# Altium schematic sheet ControlUnit.SchDoc: Control Unit
size A4; CheckedBy: none; Organization: ORGANIZATION; Address1: ADDRESS 1; Address2: ADDRESS 2; Address3: ADDRESS 3; Address4: ADDRESS 4; Revision: -; SheetNumber: 5; SheetTotal: 5; ENG_APP_DATE: --/--/--; DSN_APP_DATE: --/--/--; CHK_APP_DATE: --/--/--
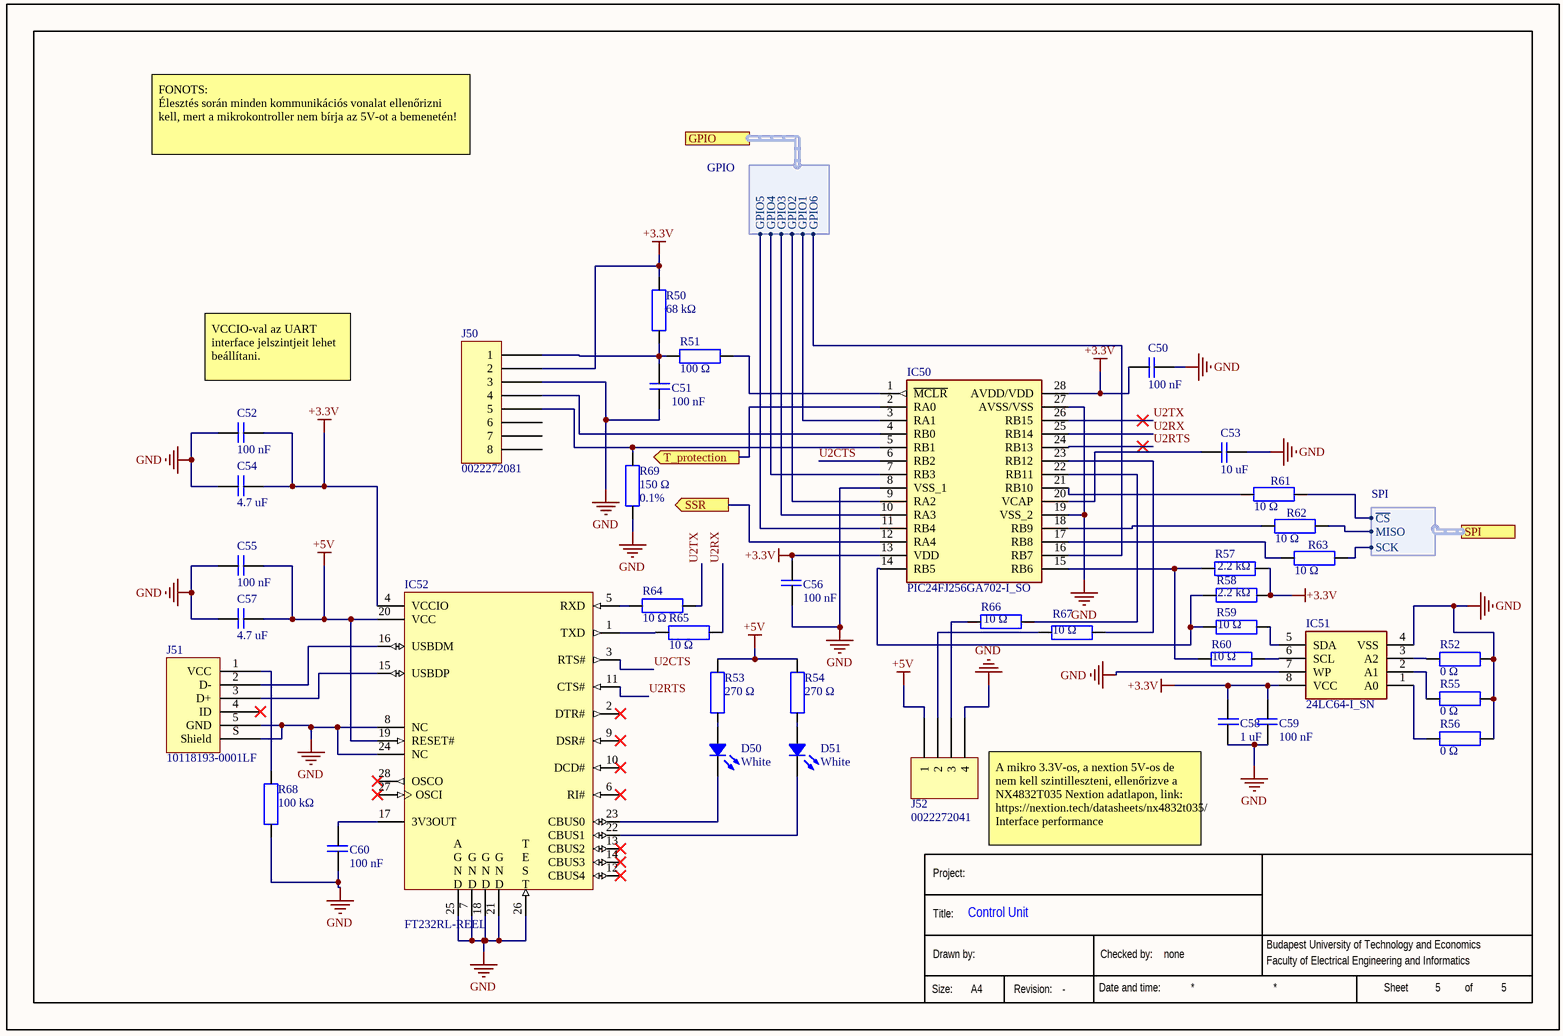
[diagram p0: ControlUnit.SchDoc]

## Parts
C50  100 nF  [1206 MLCC]
C51  100 nF  [1206 MLCC]
C52  100 nF  [1206 MLCC]
C53  10 uF  [1210 MLCC]
C54  4.7 uF  [1206 MLCC]
C55  100 nF  [1206 MLCC]
C56  100 nF  [1206 MLCC]
C57  4.7 uF  [1206 MLCC]
C58  1 uF  [1206 MLCC]
C59  100 nF  [1206 MLCC]
C60  100 nF  [1206 MLCC]
D50  White  [LED 1206_3216]
D51  White  [LED 1206_3216]
IC50  PIC24FJ256GA702-I_SO  [SOIC127P1030X265-28N]
IC51  24LC64-I_SN  [SOIC127P600X175-8N]
IC52  FT232RL-REEL  [FTDI-SSOP-28_N]
J50  0022272081  [MOLEX KK 0022272081]
J51  10118193-0001LF  [FCI USB 10118193-0001LF]
J52  0022272041  [MOLEX KK 0022272041]
R50  68 kΩ  [1206 RES]
R51  100 Ω  [1206 RES]
R52  0 Ω  [1206 RES]
R53  270 Ω  [1206 RES]
R54  270 Ω  [1206 RES]
R55  0 Ω  [1206 RES]
R56  0 Ω  [1206 RES]
R57  2.2 kΩ  [1206 RES]
R58  2.2 kΩ  [1206 RES]
R59  10 Ω  [1206 RES]
R60  10 Ω  [1206 RES]
R61  10 Ω  [1206 RES]
R62  10 Ω  [1206 RES]
R63  10 Ω  [1206 RES]
R64  10 Ω  [1206 RES]
R65  10 Ω  [1206 RES]
R66  10 Ω  [1206 RES]
R67  10 Ω  [1206 RES]
R68  100 kΩ  [0805 RES]
R69  150 Ω  Tpye: 0.1%  [1206 RES]

## Ports
GPIO (harness GPIO), SPI (harness SPI), SSR (out), T_protection (out)

## Harnesses
GPIO: GPIO6, GPIO1, GPIO2, GPIO3, GPIO4, GPIO5
SPI: ~{CS}, MISO, SCK

## Nets
+3.3V: C50.2 C52.2 C54.2 C56.2 C58.1 C59.2 IC50.13(VDD) IC50.28(AVDD/VDD) IC51.8(VCC) IC52.4(VCCIO) J50.2 R50.1 R57.1 R58.1
+5V: C55.2 C57.2 IC52.19(RESET#) IC52.20(VCC) J52.1 R53.1 R54.2
GND: C50.1 C51.2 C52.1 C53.1 C54.1 C55.1 C56.1 C57.1 C58.2 C59.1 C60.1 IC50.8(VSS_1) IC50.19(VSS_2) IC50.27(AVSS/VSS) IC51.4(VSS) IC51.7(WP) IC52.7(GND) IC52.8(NC) IC52.18(GND) IC52.21(GND) IC52.24(NC) IC52.25(AGND) IC52.26(TEST) J50.3 J51.5(GND) J51.S(Shield) J52.4 R52.1 R55.1 R56.1 R68.2 R69.2
SSR: IC50.12(RA4) ; port SSR
T_protection: IC50.2(RA0) ; port T_protection
U2CTS: IC50.6(RB2) IC52.3(RTS#)
U2RTS: IC50.24(RB13) IC52.11(CTS#)
U2RX: IC50.25(RB14) R65.1
U2TX: IC50.26(RB15) R64.1
NetC51_1: C51.1 J50.1 R50.2 R51.2
NetC53_2: C53.2 IC50.20(VCAP)
NetC60_2: C60.2 IC52.17(3V3OUT)
NetD50_1: D50.1 R53.2
NetD50_2: D50.2 IC52.23(CBUS0)
NetD51_1: D51.1 R54.1
NetD51_2: D51.2 IC52.22(CBUS1)
NetIC50_1: IC50.1(~{MCLR}) R51.1
NetIC50_3: IC50.3(RA1) ; port GPIO.GPIO1
NetIC50_4: IC50.4(RB0) J50.4
NetIC50_5: IC50.5(RB1) J50.5 R69.1
NetIC50_7: IC50.7(RB3) ; port GPIO.GPIO4
NetIC50_9: IC50.9(RA2) ; port GPIO.GPIO2
NetIC50_10: IC50.10(RA3) ; port GPIO.GPIO3
NetIC50_11: IC50.11(RB4) ; port GPIO.GPIO5
NetIC50_14: IC50.14(RB5) R58.2 R59.2
NetIC50_15: IC50.15(RB6) R57.2 R60.2
NetIC50_16: IC50.16(RB7) ; port GPIO.GPIO6
NetIC50_17: IC50.17(RB8) R63.2
NetIC50_18: IC50.18(RB9) R62.2
NetIC50_21: IC50.21(RB10) R61.2
NetIC50_22: IC50.22(RB11) R66.1
NetIC50_23: IC50.23(RB12) R67.1
NetIC51_1: IC51.1(A0) R56.2
NetIC51_2: IC51.2(A1) R55.2
NetIC51_3: IC51.3(A2) R52.2
NetIC51_5: IC51.5(SDA) R59.1
NetIC51_6: IC51.6(SCL) R60.1
NetIC52_1: IC52.1(TXD) R65.2
NetIC52_5: IC52.5(RXD) R64.2
NetIC52_15: IC52.15(USBDP) J51.3(D+)
NetIC52_16: IC52.16(USBDM) J51.2(D-)
NetJ51_1: J51.1(VCC) R68.1
NetJ52_2: J52.2 R67.2
NetJ52_3: J52.3 R66.2
NetR61_1: R61.1 ; port SPI.~{CS}
NetR62_1: R62.1 ; port SPI.MISO
NetR63_1: R63.1 ; port SPI.SCK

Not connected (* = marked no-connect by the designer): IC52 2(DTR#)* 6(RI#)* 9(DSR#)* 10(DCD#)* 12(CBUS4)* 13(CBUS2)* 14(CBUS3)* 27(OSCI)* 28(OSCO)*; J50 6 7 8; J51 4(ID)*

## Notes on the sheet
- FONOTS:
  Élesztés során minden kommunikációs vonalat ellenőrizni kell, mert a mikrokontroller nem bírja az 5V-ot a bemenetén!
- (near C52) VCCIO-val az UART interface jelszintjeit lehet beállítani.
- (near C53) No driving source error disabled.
  MCU pin configured as an output.
- A mikro 3.3V-os, a nextion 5V-os de nem kell szintilleszteni, ellenőrizve a NX4832T035 Nextion adatlapon, link: https://nextion.tech/datasheets/nx4832t035/ Interface performance
- Project:
- Title:
- Drawn by:
- Date and time:
- Checked by:
- Budapest University of Technology and Economics
- Faculty of Electrical Engineering and Informatics
- Sheet
- of
- Size:
- A4
- Revision:
- (in symbol CMP-015-00000-1) A / G / N / D; G / N / D; T / E / S / T

## Library data of the parts
C50-C60 = Capacitor: Generic MLCC; Manufacturer article no.: *
  C50-C52 C55 C56 C59 C60: Value: 100 nF
  C53: Value: 10 uF
  C54 C57: Value: 4.7 uF
  C58: Value: 1 uF
D50 D51 = LTW-C230DS: LED WHITE 1206 SMD; Manufacturer: Lite-On Inc.; Configuration: Independent; Current - Test: 20mA; Lens Color: Yellow; Lens Size: 1.50mm x 1.60mm; Lens Style: Rectangle with Flat Top; Millicandela Rating: 315mcd; Viewing Angle: 130°; Voltage - Forward (Vf) (Typ): 3.2V; Part Number: LTW-C230DS; Color: White; ComponentLink1Description: Datasheet; ComponentLink1URL: http://optoelectronics.liteon.com/upload/download/DS22-2007-0232/LTW-C230DS.pdf; ComponentLink2Description: DigiKey Link; ComponentLink2URL: http://digikey.com/product-detail/en/lite-on-inc/LTW-C230DS/160-2221-1-ND/7597462; Device Package: 1206 (3216 Metric); Height (Max): 1.10mm; LastUpdated: 2020. 09. 02. 1:22:59; Lifecycle Status: Active; Minimum Order: 1; Mounting Type: Surface Mount; Package / Case: 1206 (3216 Metric); Packaging: TapeAndReel; PartId: 933; Part Status: Active; Price: 0.13; Series: -; Size / Dimension: 3.20mm L x 1.60mm W; Supplier 1: DigiKey; Supplier Part Number 1: 160-2221-1-ND; Supplier Device Package: 1206; Value: White
IC50 = PIC24FJ256GA702-I_SO: Integrated Circuit; Manufacturer_Name: Microchip; Manufacturer_Part_Number: PIC24FJ256GA702-I/SO; Datasheet Link: https://componentsearchengine.com/Datasheets/2/PIC24FJ256GA702-I_SO.pdf; Height: 2.65mm; Mouser Part Number: 579-24FJ256GA702ISO; Mouser Price/Stock: https://www.mouser.co.uk/ProductDetail/Microchip-Technology/PIC24FJ256GA702-I-SO/?qs=tOTLKpwhCJexnk7mtThrsA%3D%3D; Arrow Part Number: PIC24FJ256GA702-I/SO; Arrow Price/Stock: https://www.arrow.com/en/products/pic24fj256ga702-iso/microchip-technology
IC51 = 24LC64-I_SN: Integrated Circuit; Manufacturer_Name: Microchip; Manufacturer_Part_Number: 24LC64-I/SN; Datasheet Link: http://ww1.microchip.com/downloads/en/DeviceDoc/21189T.pdf; Height: 1.75mm; Mouser Part Number: 579-24LC64-I/SN; Mouser Price/Stock: https://www.mouser.co.uk/ProductDetail/Microchip-Technology/24LC64-I-SN?qs=L9Ynyw3fbhEAD4VyaxHPSg%3D%3D; Arrow Part Number: 24LC64-I/SN; Arrow Price/Stock: https://www.arrow.com/en/products/24lc64-isn/microchip-technology
IC52 = CMP-015-00000-1: USB UART IC, -0.5 to 6 V, 24 mA, -40 to 85 degC, 28-Pin SSOP, RoHS, Tape and Reel; Manufacturer: Future Technology Devices International (FTDI); Max Supply Voltage: 5.25V; Data Rate: 3Mbps; Nominal Supply Voltage: 5V; Min Supply Voltage: 3.3V; Channels: 1; Case/Package: SSOP; RoHS Compliant: True; Min Operating Temperature: -40°C; Manufacturer URL: http://www.ftdichip.com/; Pins: 16; Datasheet URL: http://datasheet.octopart.com/FT232RL-FTDI-datasheet-120501.pdf; Packaging: TapeandReel; Package Quantity: 2000; Datasheet Version: Rev. 1.04, 02/2006; Max Operating Temperature: 85°C; Interface: UART
J50 = 0022272081: CONN HEADER VERT 8POS 2.54MM; Manufacturer: Molex; Contact Length - Mating: 0.295" (7.49mm); Contact Length - Post: 0.140" (3.56mm); Material Flammability Rating: UL94 V-0; Number of Positions: 8; Number of Positions Loaded: All; Overall Contact Length: 0.560" (14.22mm); Pitch - Mating: 0.100" (2.54mm); Shrouding: Shrouded - 1 Wall; Style: Board to Cable/Wire; Part Number: 0022272081; ComponentLink1Description: Datasheet; ComponentLink1URL: https://www.molex.com/pdm_docs/sd/022272081_sd.pdf; ComponentLink2Description: DigiKey Link; ComponentLink2URL: http://digikey.com/product-detail/en/molex/0022272081/WM4117-ND/1130583; Connector Type: Header; Contact Finish - Mating: Tin; Contact Finish - Post: Tin; Contact Finish Thickness - Mating: 100.0µin (2.54µm); Contact Material: Brass; Contact Shape: Square; Contact Type: Male Pin; Fastening Type: Friction Lock; Insulation Color: Natural; Insulation Height: 0.461" (11.70mm); Insulation Material: Polyamide (PA), Nylon; LastUpdated: 2020. 01. 12. 23:52:41; Lifecycle Status: Active; Minimum Order: 1; Mounting Type: Through Hole; Number of Rows: 1; Packaging: Bulk; PartId: 82; Part Status: Active; Price: 0.60; Series: KK 6410; Supplier 1: DigiKey; Supplier Part Number 1: WM4117-ND; Termination: Solder
J51 = 10118193-0001LF: CONN RCPT USB2.0 MICRO B SMD R/A; Manufacturer: Amphenol ICC (FCI); Connector Type: USB - micro B; Current Rating (Amps): 1.8A per Contact; Gender: Receptacle; Mating Cycles: 10000; Number of Contacts: 5; Number of Ports: 1; Shielding: Shielded; Voltage - Rated: 100VAC; Part Number: 10118193-0001LF; ComponentLink1Description: Datasheet; ComponentLink1URL: https://cdn.amphenol-icc.com/media/wysiwyg/files/documentation/datasheet/inputoutput/io_usb_micro.pdf; ComponentLink2Description: DigiKey Link; ComponentLink2URL: //digikey.com/product-detail/en/amphenol-icc-fci/10118193-0001LF/609-4616-2-ND/2785388; Features: Solder Retention; LastUpdated: 2019. 12. 09. 20:51:28; Lifecycle Status: 0; Minimum Order: 1; Mounting Feature: Horizontal; Mounting Type: Surface Mount, Right Angle; Through Hole; Operating Temperature: -30°C ~ 80°C; Packaging: TapeAndReel; Part Status: Active; Price: 0.21; Series: -; Specifications: USB 2.0; Supplier 1: DigiKey; Supplier Part Number 1: 609-4616-2-ND; Termination: Solder
J52 = 0022272041: CONN HEADER VERT 4POS 2.54MM; Manufacturer: Molex; Contact Length - Mating: 0.295" (7.49mm); Contact Length - Post: 0.140" (3.56mm); Material Flammability Rating: UL94 V-0; Number of Positions: 4; Number of Positions Loaded: All; Overall Contact Length: 0.560" (14.22mm); Pitch - Mating: 0.100" (2.54mm); Shrouding: Shrouded - 1 Wall; Style: Board to Cable/Wire; Part Number: 0022272041; ComponentLink1Description: Datasheet; ComponentLink1URL: https://www.molex.com/pdm_docs/sd/022272041_sd.pdf; ComponentLink2Description: DigiKey Link; ComponentLink2URL: http://digikey.com/product-detail/en/molex/0022272041/WM4113-ND/1130579; Connector Type: Header; Contact Finish - Mating: Tin; Contact Finish - Post: Tin; Contact Finish Thickness - Mating: 100.0µin (2.54µm); Contact Material: Brass; Contact Shape: Square; Contact Type: Male Pin; Fastening Type: Friction Lock; Insulation Color: Natural; Insulation Height: 0.461" (11.70mm); Insulation Material: Polyamide (PA), Nylon; LastUpdated: 2020. 01. 12. 23:52:05; Lifecycle Status: Active; Minimum Order: 1; Mounting Type: Through Hole; Number of Rows: 1; Packaging: Bulk; PartId: 78; Part Status: Active; Price: 0.40; Series: KK 6410; Supplier 1: DigiKey; Supplier Part Number 1: WM4113-ND; Termination: Solder
R50-R68 = Resitor: Generic SMD resistor
  R50: Value: 68 kΩ
  R51: Value: 100 Ω
  R52 R55 R56: Value: 0 Ω
  R53 R54: Value: 270 Ω
  R57 R58: Value: 2.2 kΩ
  R59-R67: Value: 10 Ω
  R68: Value: 100 kΩ
R69 = Resitor: Precision SMD resistor; Value: 150 Ω